# Altium schematic sheet УШЯИ.687242.236Э3_1.SchDoc
size 209 x 297 mm; SheetTotal: 1
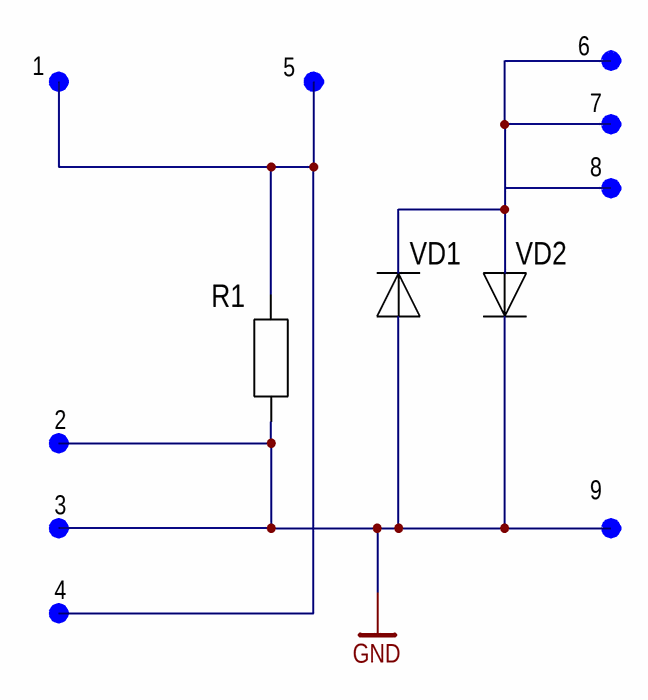
[diagram p0: УШЯИ.687242.236Э3_1.SchDoc]

## Parts
1  OTV18  [OTV18]  (value not drawn)  (no BOM)
2  OTV34  [OTV34]  (value not drawn)  (no BOM)
3  OTV11  [OTV11]  (value not drawn)  (no BOM)
4  OTV11  [OTV11]  (value not drawn)  (no BOM)
5  OTV34  [OTV34]  (value not drawn)  (no BOM)
6  OTV18  [OTV18]  (value not drawn)  (no BOM)
7  OTV18  [OTV18]  (value not drawn)  (no BOM)
8  OTV18  [OTV18]  (value not drawn)  (no BOM)
9  OTV34  [OTV34]  (value not drawn)  (no BOM)
R1  OAR3-R005FI  [OAR3]  (value not drawn)
VD1  43CTQ100  [TO-220(F)]  (value not drawn)
VD2  43CTQ100  [TO-220(F)]  (value not drawn)

## Nets
GND: 2.1 3.1 9.1 R1.1 VD1.1 VD2.2
Net1_1: 1.1 4.1 5.1 R1.2
Net6_1: 6.1 7.1 8.1 VD1.2 VD2.1

## Notes on the sheet
- Перв. примен.
- Справ. №
- Подп. дата
- Инв. № дубл.
- Взам. инв. №
- Подп. и дата
- Изм.
- Разраб.
- Лист
- № докум.
- Подп.
- Дата
- Лит.
- Масса
- Масштаб
- Пров.
- Т.контр.
- Листов
- Инв. № подл.
- Н.контр.
- Утв.
- Файл:
- ALTIUM GOSTBOM2.0 KEV
- Копировал
- Формат А4

## Library data of the parts
R1 = OAR3-R010FLF: ModelPrint: 0402; Value: 0.005 Ом
VD1 VD2 = 43CTQ100: High Performance Schottky Rectifier, 2 x 20 A; pin to pad: 1>1+3; Value: *